# EAGLE design PIC12F675_dev (EAGLE 5.06)
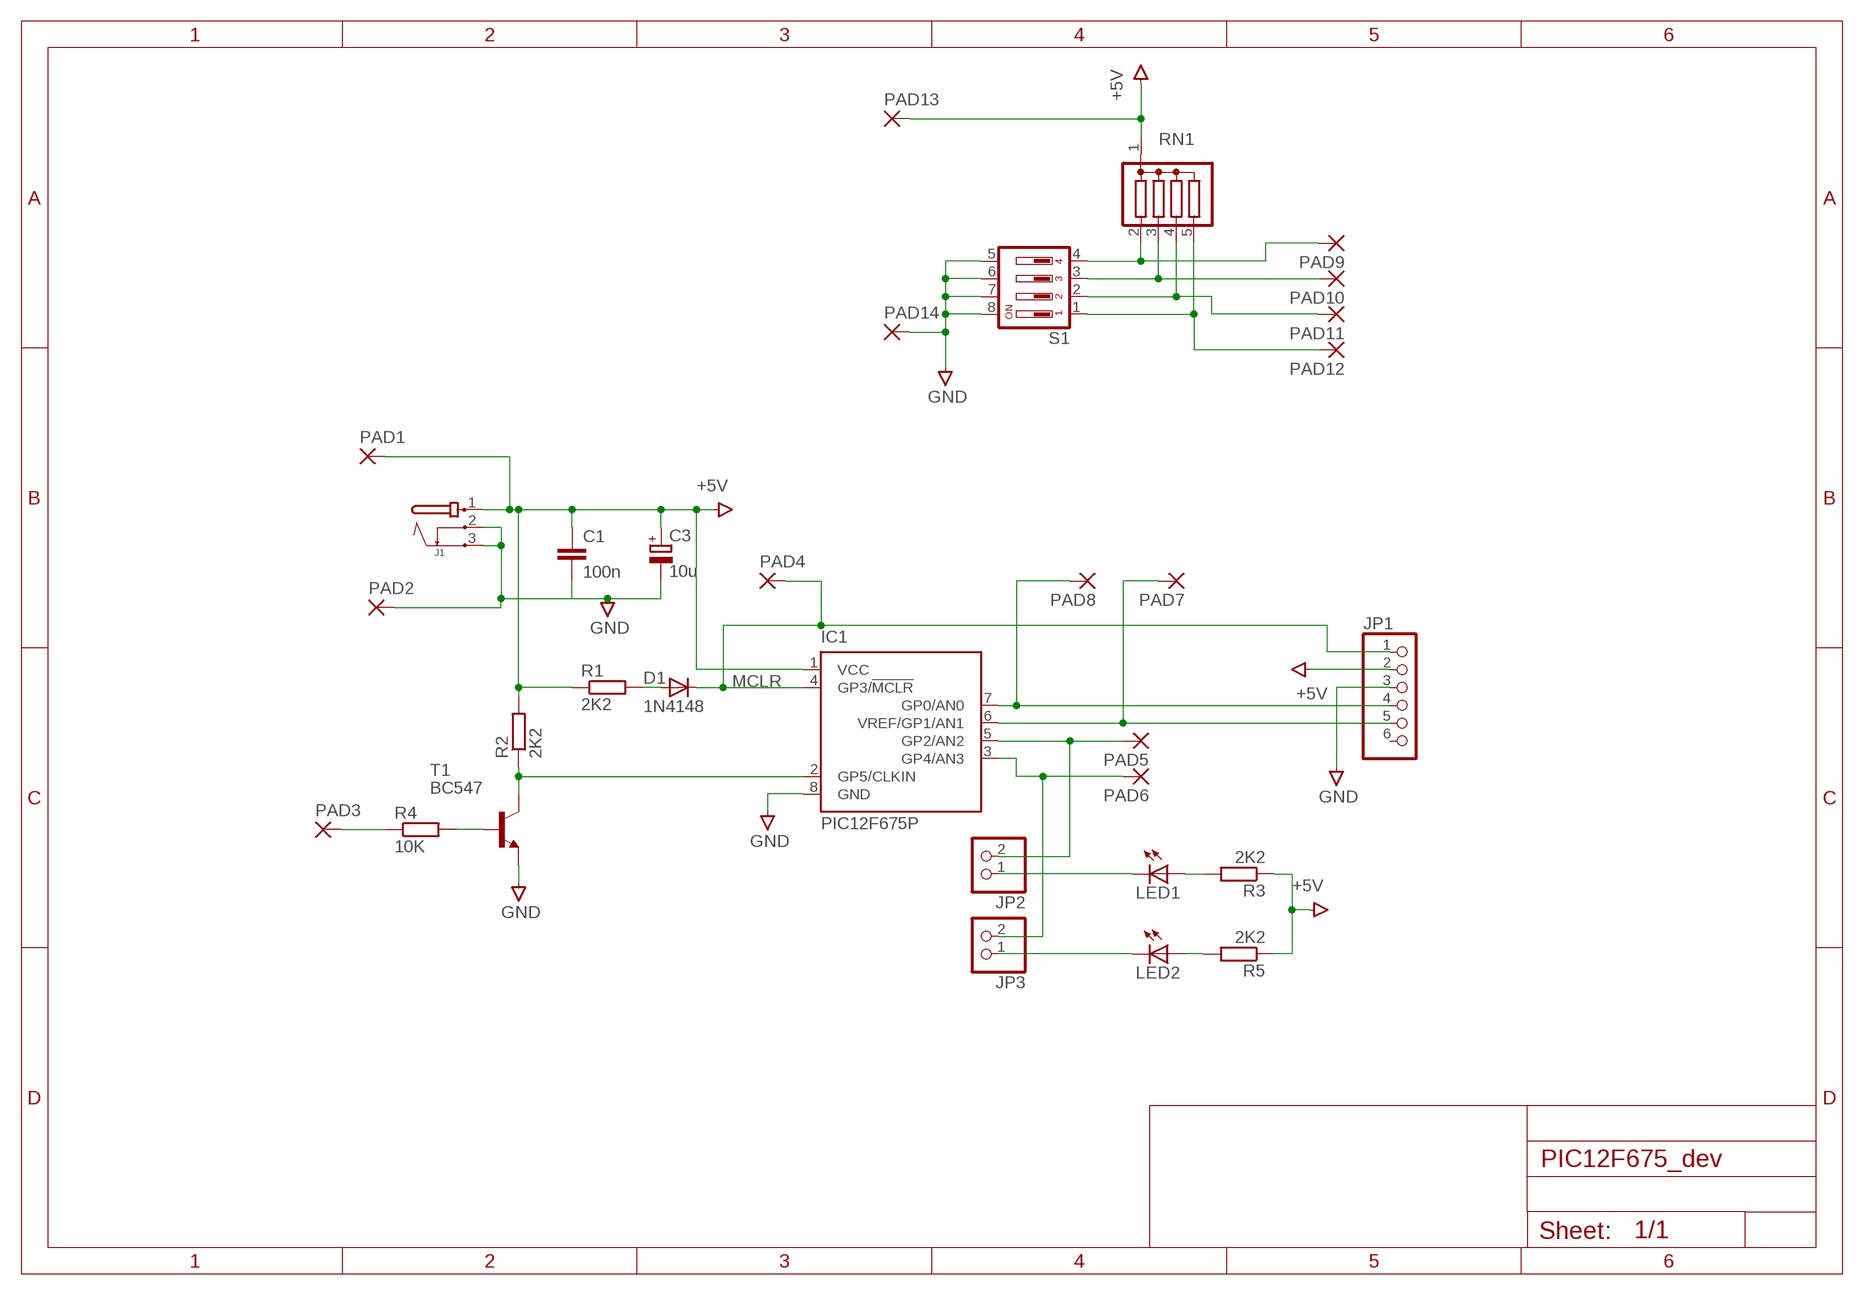
[diagram p0: schematic, sheet 1]

## Parts
C1  100n  C-EU050-035X075  [C050-035X075]
C3  10u  CPOL-EUE2.5-5  [E2,5-5]
D1  1N4148  1N4148DO35-7  [DO35-7]
IC1  PIC12F675P  [DIL8]
J1  JACK-PMS  [JACK-PMS]
JP1  PINHD-1X6  [1X06]
JP2  PINHD-1X2  [1X02]
JP3  PINHD-1X2  [1X02]
LED1  LED3MM  [LED3MM]
LED2  LED3MM  [LED3MM]
PAD1  2,15/1,0  [2,15/1,0]
PAD2  2,15/1,0  [2,15/1,0]
PAD3  2,15/1,0  [2,15/1,0]
PAD4  2,15/1,0  [2,15/1,0]
PAD5  2,15/1,0  [2,15/1,0]
PAD6  2,15/1,0  [2,15/1,0]
PAD7  2,15/1,0  [2,15/1,0]
PAD8  2,15/1,0  [2,15/1,0]
PAD9  1,6/0,8  [1,6/0,8]
PAD10  1,6/0,8  [1,6/0,8]
PAD11  1,6/0,8  [1,6/0,8]
PAD12  1,6/0,8  [1,6/0,8]
PAD13  2,15/1,0  [2,15/1,0]
PAD14  2,15/1,0  [2,15/1,0]
R1  2K2  R-EU_0204/7  [0204/7]
R2  2K2  R-EU_0204/7  [0204/7]
R3  2K2  R-EU_0204/7  [0204/7]
R4  10K  R-EU_0204/7  [0204/7]
R5  2K2  R-EU_0204/7  [0204/7]
RN1  G04R  [SIL5]
S1  DIP04YL  [DIP04YL]
T1  BC547  [TO92]

## Nets
+5V: C1.1 C3.+ IC1.1(VCC) J1.1 JP1.2 PAD1.1(P) PAD13.1(P) R1.1 R2.2 R3.1 R5.1 RN1.1
GND: C1.2 C3.- IC1.8(GND) J1.2 J1.3 JP1.3 PAD2.1(P) PAD14.1(P) S1.5 S1.6 S1.7 S1.8 T1.1(E)
MCLR: D1.C IC1.4(GP3/!MCLR) JP1.1 PAD4.1(P)
N$1: IC1.2(GP5/CLKIN) R2.1 T1.3(C)
N$2: D1.A R1.2
N$3: R4.2 T1.2(B)
N$4: LED1.A R3.2
N$5: IC1.5(GP2/AN2) JP2.2 PAD5.1(P)
N$6: IC1.3(GP4/AN3) JP3.2 PAD6.1(P)
N$7: IC1.7(GP0/AN0) JP1.4 PAD8.1(P)
N$8: IC1.6(VREF/GP1/AN1) JP1.5 PAD7.1(P)
N$9: PAD9.1(P) RN1.2 S1.4
N$10: LED2.A R5.2
N$11: JP3.1 LED2.K(C)
N$12: JP2.1 LED1.K(C)
N$13: PAD3.1(P) R4.1
N$14: PAD10.1(P) RN1.3 S1.3
N$15: PAD11.1(P) RN1.4 S1.2
N$16: PAD12.1(P) RN1.5 S1.1
Unconnected: JP1.6

## Library data of the parts
C1 = rcl:C-EU: CAPACITOR, European symbol
C3 = rcl:CPOL-EU: POLARIZED CAPACITOR, European symbol
D1 = diode:1N4148: DIODE high speed (Philips)
IC1 = microchip:PIC12F675: 8-Pin FLASH-Based 8-Bit CMOS Microcontroller Precision Internal 4 MHz oscillator factory calibrated to ±1% Low Power Features: Standby Current: - 1 nA @ 2.0V, typical Operating Current: - 8.5µA @ 32 kHz, 2.0V, typical - 100µA @ 1 MHz, 2.0V, typical Watchdog Timer Current: - 300 nA @ 2.0V, typical Timer1 oscillator current: - 4µA @ 32 kHz, 2.0V, typical Analog-to-Digital Converter module: - 10-bit resolution - Programmable 4-channel input - Voltage reference input Source: http://www.microchip.com .. 41190E.pdf
J1 = POWER-IN:JACK-PMS
JP1 = pinhead:PINHD-1X6: PIN HEADER
JP2 JP3 = pinhead:PINHD-1X2: PIN HEADER
LED1 LED2 = led:LED: LED OSRAM: - CHIPLED LG R971, LG N971, LY N971, LG Q971, LY Q971, LO R971, LY R971 LH N974, LH R974 LS Q976, LO Q976, LY Q976 LO Q996 - Hyper CHIPLED LW Q18S LB Q993, LB Q99A, LB R99A - SideLED LS A670, LO A670, LY A670, LG A670, LP A670 LB A673, LV A673, LT A673, LW A673 LH A674 LY A675 LS A676, LA A676, LO A676, LY A676, LW A676 LS A679, LY A679, LG A679 - Hyper Micro SIDELED® LS Y876, LA Y876, LO Y876, LY Y876 LT Y87S - SmartLED LW L88C, LW L88S LB L89C, LB L89S, LG L890 LS L89K, LO L89K, LY L89K LS L896, LA L896, LO L896, LY L896 - TOPLED LS T670, LO T670, LY T670, LG T670, LP T670 LSG T670, LSP T670, LSY T670, LOP T670, LYG T670 LG T671, LOG T671, LSG T671 LB T673, LV T673, LT T673, LW T673 LH T674 LS T676, LA T676, LO T676, LY T676, LB T676, LH T676, LSB T676, LW T676 LB T67C, LV T67C, LT T67C, LS T67K, LO T67K, LY T67K, LW E67C LS E67B, LA E67B, LO E67B, LY E67B, LB E67C, LV E67C, LT E67C LW T67C LS T679, LY T679, LG T679 LS T770, LO T770, LY T770, LG T770, LP T770 LB T773, LV T773, LT T773, LW T773 LH T774 LS E675, LA E675, LY E675, LS T675 LS T776, LA T776, LO T776, LY T776, LB T776 LHGB T686 LT T68C, LB T68C - Hyper Mini TOPLED® LB M676 - Mini TOPLED Santana® LG M470 LS M47K, LO M47K, LY M47K Source: http://www.osram.convergy.de LUXEON: - LUMILED® LXK2-PW12-R00, LXK2-PW12-S00, LXK2-PW14-U00, LXK2-PW14-V00 LXK2-PM12-R00, LXK2-PM12-S00, LXK2-PM14-U00 LXK2-PE12-Q00, LXK2-PE12-R00, LXK2-PE12-S00, LXK2-PE14-T00, LXK2-PE14-U00 LXK2-PB12-K00, LXK2-PB12-L00, LXK2-PB12-M00, LXK2-PB14-N00, LXK2-PB14-P00, LXK2-PB14-Q00 LXK2-PR12-L00, LXK2-PR12-M00, LXK2-PR14-Q00, LXK2-PR14-R00 LXK2-PD12-Q00, LXK2-PD12-R00, LXK2-PD12-S00 LXK2-PH12-R00, LXK2-PH12-S00 LXK2-PL12-P00, LXK2-PL12-Q00, LXK2-PL12-R00 Source: www.luxeon.com KINGBRIGHT: KA-3528ASYC Source: www.kingbright.com
PAD1-PAD8 PAD13 PAD14 = wirepad:2,15/1,0: THROUGH-HOLE PAD
PAD9-PAD12 = wirepad:1,6/0,8: THROUGH-HOLE PAD
R1-R5 = rcl:R-EU_: RESISTOR, European symbol
RN1 = resistor-sil:G04R: SIL RESISTOR
S1 = switch-dil:DIP04YL: DIL/CODE SWITCH
T1 = transistor:BC547: NPN TRANSISTOR

## Board
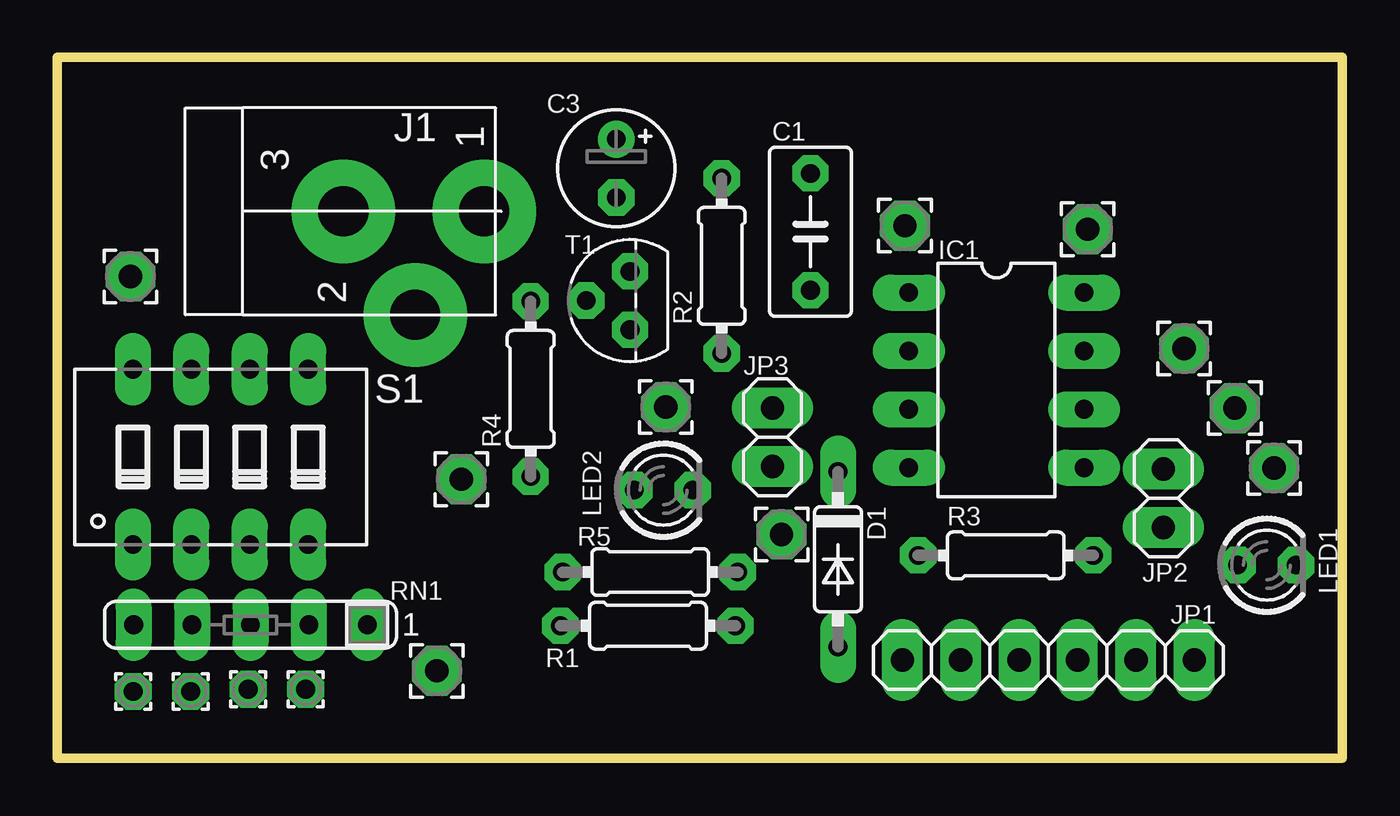
[diagram p1: board, top side]
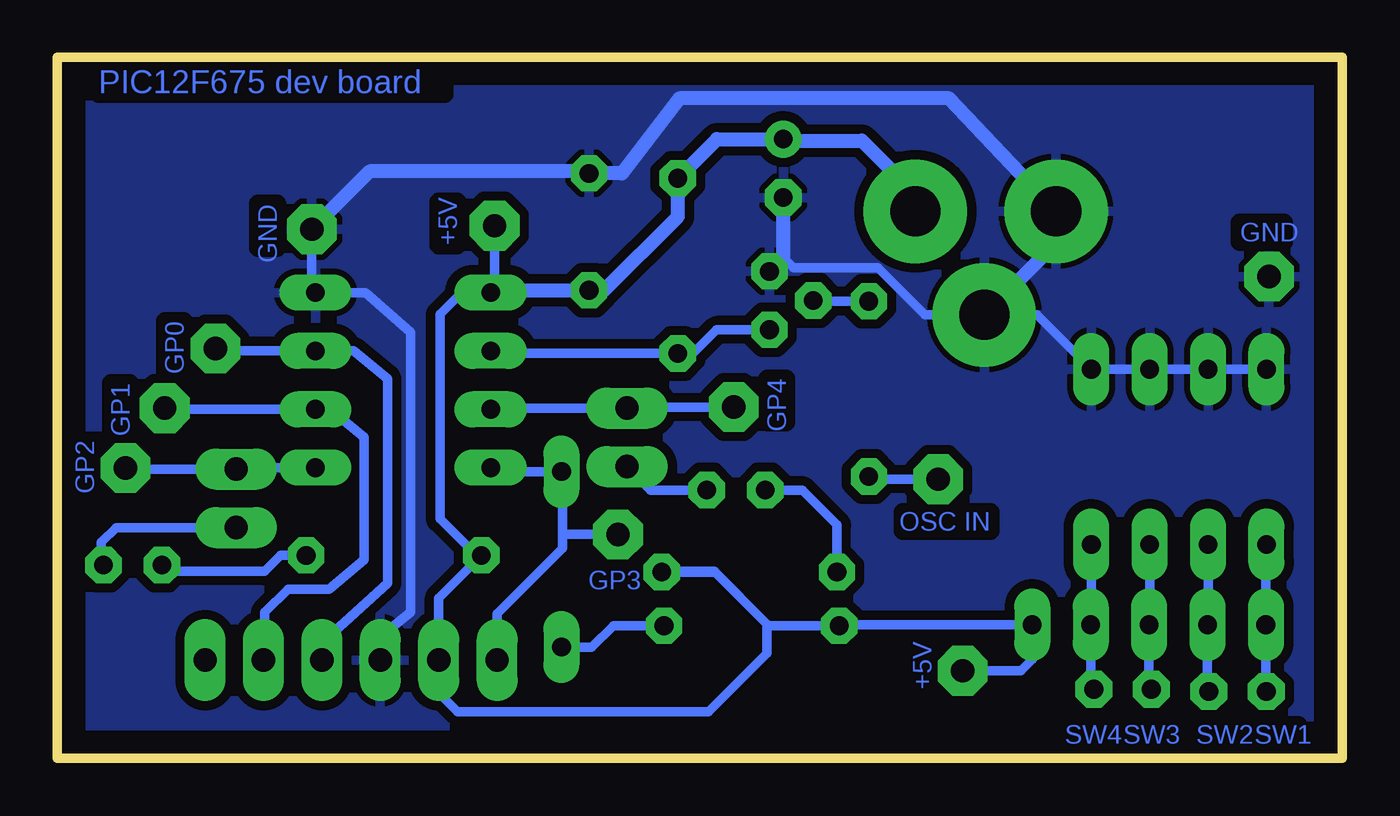
[diagram p2: board, bottom side, seen from below]

Size 55.88 x 30.48 mm. Coordinates in mm from the lower left corner, seen from the top.
Outline: 0,0 0,30.48 55.88,30.48 55.88,0 0,0
Copper layers (1*16): Top 0.035mm / dielectric 1.5mm / Bottom 0.035mm
Design rules "homepcb": minimum track width 10mil, minimum drill 20mil, track to track 10mil, track to pad 10mil, pad to pad 10mil, via to via 10mil, smd to smd 10mil, copper to edge 40mil, drill to drill 10mil, minimum pad ring 15mil, minimum via ring 10mil, stop-mask expansion 0mil, vias tented up to drill 0mil, thermal gap 10mil

### Footprints (pad centres in the part's own frame; a part is rotated, then mirrored left to right if it is on the bottom)
C050-035X075 = drill 0.813 octagon: 1 -2.54,0; 2 2.54,0
E2,5-5 = drill 0.813 pad 1.6 round: + -1.27,0 | drill 0.813 pad 1.6 octagon: - 1.27,0
DO35-7 = drill 0.813 long: A 3.81,0; C -3.81,0
DIL8 = drill 0.813 long: 1 -3.81,-3.81; 2 -1.27,-3.81; 3 1.27,-3.81; 4 3.81,-3.81; 5 3.81,3.81; 6 1.27,3.81; 7 -1.27,3.81; 8 -3.81,3.81
JACK-PMS = drill 2.184 pad 4.5 round: 1 -0.5,-3.31; 2 -5,-0.31; 3 -0.5,2.809
1X06 = drill 1.016 long: 1 -6.35,0; 2 -3.81,0; 3 -1.27,0; 4 1.27,0; 5 3.81,0; 6 6.35,0
1X02 = drill 1.016 long: 1 -1.27,0; 2 1.27,0
LED3MM = drill 0.813 octagon: A -1.27,0; K 1.27,0
2,15/1,0 = drill 1.016 pad 2.159 octagon: 1 0,0
1,6/0,8 = drill 0.813 pad 1.6 octagon: 1 0,0
0204/7 = drill 0.813 octagon: 1 -3.81,0; 2 3.81,0
SIL5 = drill 0.813 long: 1 -5.08,0; 2 -2.54,0; 3 0,0; 4 2.54,0; 5 5.08,0
DIP04YL = drill 0.813 long: 1 -3.81,-3.81; 2 -1.27,-3.81; 3 1.27,-3.81; 4 3.81,-3.81; 5 3.81,3.81; 6 1.27,3.81; 7 -1.27,3.81; 8 -3.81,3.81
TO92 = drill 0.813 octagon: 1 1.27,0; 2 0,1.905; 3 -1.27,0

### Placement (x,y rotation side)
C1  32.75,22.9 90 top
C3  24.3,25.66 270 top
D1  33.95,8.66 270 top
IC1  40.84,16.45 270 top
J1  15.25,24.29 90 top
JP1  43.1,4.27 0 top
JP2  48.1,11.31 90 top
JP3  31.1,13.96 90 top
LED1  52.61,8.41 0 top
LED2  26.36,11.67 0 top
PAD1  36.87,23.17 270 top
PAD2  44.82,23.01 90 top
PAD3  17.56,12.14 0 top
PAD4  31.5,9.74 0 top
PAD5  52.93,12.63 0 top
PAD6  26.46,15.28 0 top
PAD7  51.21,15.23 0 top
PAD8  49.02,17.83 0 top
PAD9  10.79,3.01 0 top
PAD10  8.29,3.01 0 top
PAD11  5.79,2.91 0 top
PAD12  3.29,2.91 0 top
PAD13  16.51,3.81 0 top
PAD14  3.17,20.95 0 top
R1  25.69,5.77 0 top
R2  28.89,21.42 90 top
R3  41.25,8.83 0 top
R4  20.58,16.07 90 top
R5  25.79,8.1 180 top
RN1  8.4,5.81 180 top
S1  7.09,13.11 0 top
T1  24.9,19.91 90 top

### Tracks (layer width: path | path; a pad name or v marks a point on that pad's centre or on a via)
+5V
  Bottom 0.406: IC1.1 36.94,20.36 | R2.2 28.33,25.79 | PAD1.1 36.87,20.43 IC1.1 | IC1.1 37.09,20.32 38.23,20.32 39.24,19.3 39.24,10.41 37.66,8.83 R3.1 39.3,6.97 JP1.2 39.24,4.22 39.24,2.79 38.48,2.03 27.56,2.03 25.02,4.57 25.02,5.84 | 25.02,5.84 24.95,5.77 R1.1 21.93,5.71 22.22,5.71 22.13,5.81 RN1.1 13.48,4.3 13.97,3.81 15.88,3.81 PAD13.1 | 25.02,5.84 27.3,8.13 29.57,8.13 R5.1 27.28,8.1 25.02,5.84
  Bottom 0.61: 36.94,20.36 C1.1 32.09,20.36 28.89,23.56 R2.2 27.2,26.93 C3.+ 24.23,26.86 20.89,26.86 18.67,24.64 18.67,23.9 J1.1
GND
  Bottom 0.406: C1.2 32.84,25.53 | PAD2.1 44.82,20.42 IC1.8 42.48,20.26 40.51,18.54 40.51,6.35 41.78,5.33 41.78,4.33 JP1.3 | 24.3,21.78 23.86,21.34 20.19,21.34 18.15,19.29 J1.2 13.28,19.29 S1.5 S1.6 S1.7 S1.8
  Bottom 0.61: C3.- 24.3,21.78 T1.1 | 32.84,25.53 42.3,25.53 PAD2.1 | J1.2 12.44,22.41 J1.3 17.1,28.7 28.83,28.7 31.33,25.44 C1.2
  pour Bottom (isolate 0.406): 0,30.48 55.88,30.48 55.88,29.21 55.88,0 0,0
MCLR
  Bottom 0.406: IC1.4 36.87,12.47 D1.C 33.91,12.42 33.91,9.91 | JP1.1 36.75,6.3 33.91,9.14 33.91,9.91 | PAD4.1 33.75,9.74 33.91,9.91
N$1
  Bottom 0.406: T1.3 27.21,18.64 28.32,17.53 28.81,17.53 R2.1 36.92,17.61 IC1.2
N$2
  Bottom 0.406: R1.2 31.7,5.77 32.64,4.83 33.93,4.83 D1.A
N$3
  Bottom 0.406: R4.2 22.97,19.88 T1.2
N$4
  Bottom 0.406: R3.2 46.16,8.83 46.86,8.13 51.06,8.13 LED1.A
N$5
  Bottom 0.406: IC1.5 48.05,12.64 JP2.2 51.87,12.58 PAD5.1
N$6
  Bottom 0.406: IC1.3 36.98,15.23 JP3.2 31.05,15.28 PAD6.1
N$7
  Bottom 0.406: JP1.4 44.32,4.33 44.32,5.08 41.53,7.62 41.53,16.51 42.99,17.72 IC1.7 48.91,17.72 PAD8.1
N$8
  Bottom 0.406: JP1.5 46.86,4.33 46.86,6.35 45.85,7.37 44.07,7.37 42.55,8.64 42.55,13.97 44.01,15.18 IC1.6 51.16,15.18 PAD7.1
N$9
  Bottom 0.406: S1.4 10.91,5.84 RN1.2 10.94,3.15 PAD9.1
N$10
  Bottom 0.406: LED2.A 23.48,11.67 21.97,10.16 21.97,7.85 R5.2
N$11
  Bottom 0.406: LED2.K 30.08,11.67 JP3.1
N$12
  Bottom 0.406: JP2.1 53.33,10.04 53.98,9.4 53.98,8.5 LED1.K
N$13
  Bottom 0.406: PAD3.1 20.46,12.14 R4.1
N$14
  Bottom 0.406: S1.3 8.37,5.84 RN1.3 8.4,3.11 PAD10.1
N$15
  Bottom 0.406: S1.2 5.83,5.84 RN1.4 5.85,2.97 PAD11.1
N$16
  Bottom 0.406: PAD12.1 3.31,2.91 RN1.5 3.31,9.3 S1.1

### Text on the board
Bottom: PIC12F675 dev board | GND | GND | +5V | GP0 | GP4 | GP1 | GP2 | OSC IN | GP3 | +5V | SW1 | SW2 | SW3 | SW4